# Altium schematic sheet ESP32_BLE.SchDoc: Access Control
size A; DrawnBy: Q.Thang & T.Khoa; Revision: V1.0.1; SheetNumber: 6; SheetTotal: 16
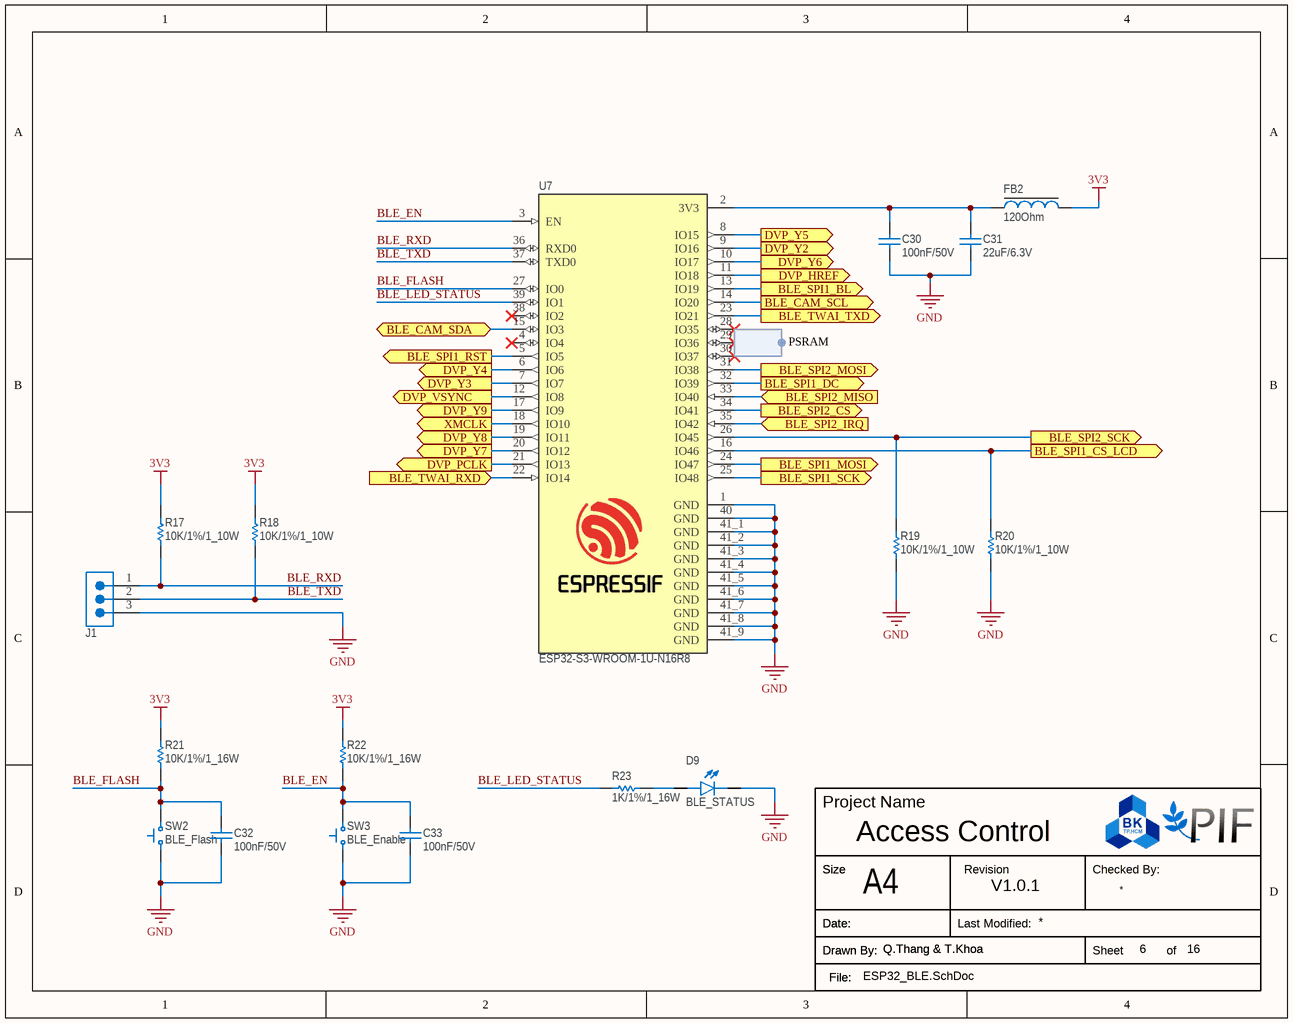
[diagram p0: ESP32_BLE.SchDoc]

## Parts
C30  100nF/50V  [CAP_0805]
C31  22uF/6.3V  [CAP_0805]
C32  100nF/50V  [CAP_0402]
C33  100nF/50V  [CAP_0402]
D9  BLE_STATUS  [LED_0603Y]
FB2  120Ohm  [Ferrite_Bead_0805]
J1  2.54mm_2P  [Header_2.54mm_3P]  (value not drawn)
R17  10K/1%/1_10W  [Resistor_0603]
R18  10K/1%/1_10W  [Resistor_0603]
R19  10K/1%/1_10W  [Resistor_0603]
R20  10K/1%/1_10W  [Resistor_0603]
R21  10K/1%/1_16W  [RESISTOR_0402]
R22  10K/1%/1_16W  [RESISTOR_0402]
R23  1K/1%/1_16W  [RESISTOR_0402]
SW2  BLE_Flash  [Button_3x4mm_SMD_2P]
SW3  BLE_Enable  [Button_3x4mm_SMD_2P]
U7  ESP32-S3-WROOM-1U-N16R8  [XCVR_ESP32-S3-WROOM-1U-N16R8]

## Ports
BLE_CAM_SCL (out, see Overview_Schematic[3B], Camera[2B]), BLE_CAM_SDA (bidir, see Overview_Schematic[3B], Camera[2B]), BLE_SPI1_BL (out, see Overview_Schematic[4C], Display[1D]), BLE_SPI1_CS_LCD (out, see Overview_Schematic[3C], Display[2A]), BLE_SPI1_DC (out, see Overview_Schematic[3C], Display[2A]), BLE_SPI1_MOSI (out, see Overview_Schematic[3C], Display[2A]), BLE_SPI1_RST (out, see Overview_Schematic[3C], Display[2A]), BLE_SPI1_SCK (out, see Overview_Schematic[3C], Display[2B]), BLE_SPI2_CS (out, see Overview_Schematic[3C], Display[2B]), BLE_SPI2_IRQ (in, see Overview_Schematic[3C], Display[2B]), BLE_SPI2_MISO (in, see Overview_Schematic[3C], Display[2B]), BLE_SPI2_MOSI (out, see Overview_Schematic[3C], Display[2B]), BLE_SPI2_SCK (out, see Overview_Schematic[3C], Display[2B]), BLE_TWAI_RXD (in, see Overview_Schematic[4B]), BLE_TWAI_TXD (out, see Overview_Schematic[4B]), DVP_HREF (out, see Overview_Schematic[3B], Camera[3B]), DVP_PCLK (out, see Overview_Schematic[3B], Camera[3B]), DVP_VSYNC (out, see Overview_Schematic[3B], Camera[3B]), DVP_Y2 (out, see Overview_Schematic[3B], Camera[3C]), DVP_Y3 (out, see Overview_Schematic[3B], Camera[3C]), DVP_Y4 (out, see Overview_Schematic[3B], Camera[3C]), DVP_Y5 (out, see Overview_Schematic[3B], Camera[3C]), DVP_Y6 (out, see Overview_Schematic[3B], Camera[3B]), DVP_Y7 (out, see Overview_Schematic[3B], Camera[3B]), DVP_Y8 (out, see Overview_Schematic[3B], Camera[3B]), DVP_Y9 (out, see Overview_Schematic[3B], Camera[3B]), XMCLK (out, see Overview_Schematic[3B], Camera[3B])

## Harnesses
*: 

## Nets
3V3: FB2.2 R17.2 R18.2 R21.2 R22.2
GND: C30.1 C31.1 C32.1 C33.1 D9.C J1.3 R19.1 R20.1 SW2.1 SW3.1 U7.1(GND) U7.40(GND) U7.41_1(GND) U7.41_2(GND) U7.41_3(GND) U7.41_4(GND) U7.41_5(GND) U7.41_6(GND) U7.41_7(GND) U7.41_8(GND) U7.41_9(GND)
BLE_CAM_SCL: U7.14(IO20) ; port BLE_CAM_SCL
BLE_CAM_SDA: U7.15(IO3) ; port BLE_CAM_SDA
BLE_EN: C33.2 R22.1 SW3.2 U7.3(EN)
BLE_FLASH: C32.2 R21.1 SW2.2 U7.27(IO0)
BLE_LED_STATUS: R23.1 U7.39(IO1)
BLE_RXD: J1.1 R17.1 U7.36(RXD0)
BLE_SPI1_BL: U7.13(IO19) ; port BLE_SPI1_BL
BLE_SPI1_CS_LCD: R20.2 U7.16(IO46) ; port BLE_SPI1_CS_LCD
BLE_SPI1_DC: U7.32(IO39) ; port BLE_SPI1_DC
BLE_SPI1_MOSI: U7.24(IO47) ; port BLE_SPI1_MOSI
BLE_SPI1_RST: U7.5(IO5) ; port BLE_SPI1_RST
BLE_SPI1_SCK: U7.25(IO48) ; port BLE_SPI1_SCK
BLE_SPI2_CS: U7.34(IO41) ; port BLE_SPI2_CS
BLE_SPI2_IRQ: U7.35(IO42) ; port BLE_SPI2_IRQ
BLE_SPI2_MISO: U7.33(IO40) ; port BLE_SPI2_MISO
BLE_SPI2_MOSI: U7.31(IO38) ; port BLE_SPI2_MOSI
BLE_SPI2_SCK: R19.2 U7.26(IO45) ; port BLE_SPI2_SCK
BLE_TWAI_RXD: U7.22(IO14) ; port BLE_TWAI_RXD
BLE_TWAI_TXD: U7.23(IO21) ; port BLE_TWAI_TXD
BLE_TXD: J1.2 R18.1 U7.37(TXD0)
DVP_HREF: U7.11(IO18) ; port DVP_HREF
DVP_PCLK: U7.21(IO13) ; port DVP_PCLK
DVP_VSYNC: U7.12(IO8) ; port DVP_VSYNC
DVP_Y2: U7.9(IO16) ; port DVP_Y2
DVP_Y3: U7.7(IO7) ; port DVP_Y3
DVP_Y4: U7.6(IO6) ; port DVP_Y4
DVP_Y5: U7.8(IO15) ; port DVP_Y5
DVP_Y6: U7.10(IO17) ; port DVP_Y6
DVP_Y7: U7.20(IO12) ; port DVP_Y7
DVP_Y8: U7.19(IO11) ; port DVP_Y8
DVP_Y9: U7.17(IO9) ; port DVP_Y9
XMCLK: U7.18(IO10) ; port XMCLK
NetC30_2: C30.2 C31.2 FB2.1 U7.2(3V3)
NetD9_A: D9.A R23.2

Not connected (* = marked no-connect by the designer): U7 4(IO4)* 28(IO35)* 29(IO36)* 30(IO37)* 38(IO2)*

## Notes on the sheet
- PSRAM
- Project Name
- Size
- A4
- Revision
- Checked By:
- Drawn By:
- Date:
- File:
- Last Modified:
- Sheet
- of

## Library data of the parts
C30 = Ceramic_Cap_100nF_50V_0805: CAP, size 0805, 100nF, 50V; Supply Part Number: Tụ Gốm 0805 100nF (0.1uF) 50V; Supply Name: Thegioiic; Datasheet: *; Supply URL: https://www.thegioiic.com/tu-gom-0805-100nf-0-1uf-50v
C31 = Ceramic_Cap_22uF_6.3V_0805: CAP, size 0805, 22uF, 6.3V; Supply Part Number: Tụ Gốm 0805 22uF 6.3V; Supply Name: Thegioiic; Datasheet: *; Supply URL: https://www.thegioiic.com/tu-gom-0805-22uf-6-3v
C32 C33 = Ceramic_Cap_100nF_50V_0402: CAP, size 0402, 100nF, 50V; Supply Part Number: Tụ Gốm 0402 100nF (0.1uF) 50V; Supply Name: Thegioiic; Datasheet: *; Supply URL: https://www.thegioiic.com/tu-gom-0402-100nf-0-1uf-50v
D9 = LED_Yellow_0603: LED Yellow 0603; Supply Part Number: LED Vàng 0603 Dán SMD Trong Suốt Harvatek; Supply Name: Thegioiic; Supply URL: https://www.thegioiic.com/led-vang-0603-dan-smd-trong-suot-harvatek
FB2 = Ferrite_Bead_120Ohm_2A_0805: Ferrite Bead, size 0805, 120Ohm, 2A; Supply Part Number: CBW201209U121T Ferrite Beads 2A 120 Ohm 0805; Supply Name: Thegioiic; Supply URL: https://www.thegioiic.com/cbw201209u121t-ferrite-beads-2a-120-ohm-0805
J1 = Header_2.54mm_3P: Hàng Rào Đực Đơn 2.54mm 40 Chân 1 Hàng Cao 11.2mm Xuyên Lỗ; Supply Name: Thegioiic; Supply Part Number: Hàng Rào Đực Đơn 2.54mm 40 Chân 1 Hàng Cao 11.2mm Xuyên Lỗ; Supply URL: https://www.thegioiic.com/hang-rao-duc-don-2-54mm-40-chan-1-hang-cao-11-2mm-xuyen-lo
R17-R20 = Res_10K_0603_1%: Resistor 0603 10KOhm 1% 1_10W; Supply Part Number: Điện Trở 10 KOhm 0603 1%; Supply Name: Thegioiic; Supply URL: https://www.thegioiic.com/dien-tro-10-kohm-0603-1-
R21 R22 = Res_10K_0402_1%: Resistor 0402 10KOhm 1% 1_16W; Supply Part Number: Điện Trở 10 KOhm 0402 1%; Supply Name: Thegioiic; Supply URL: https://www.thegioiic.com/dien-tro-10-kohm-0402-1-
R23 = Res_1K_0402_1%: Resistor 0402 1KOhm 1% 1_16W; Supply Part Number: Điện Trở 1 KOhm 0402 1%; Supply Name: Thegioiic; Supply URL: https://www.thegioiic.com/dien-tro-1-kohm-0402-1-
SW2 SW3 = Button_SMD_3x4mm_2P: Supply Part Number: Nút Nhấn 3x4mm Cao 2.5mm 2 Chân SMD; Supply Name: Thegioiic; Datasheet: *; Supply URL: https://www.thegioiic.com/nut-nhan-3x4mm-cao-2-5mm-2-chan-smd
U7 = ESP32-S3-WROOM-1U-N16R8: Bluetooth, WiFi 802.11b/g/n, Bluetooth v5.0 Transceiver Module 2.4GHz Antenna Not Included, U.FL Surface Mount; Supply Part Number: ESP32-S3-WROOM-1U-N16R8 Thu Phát Wifi BLE ESP32 16MB; Supply Name: DienTuTuyetNga; Datasheet: https://www.espressif.com/sites/default/files/documentation/esp32-s3_datasheet_en.pdf; Supply URL: https://dientutuyetnga.com/products/esp32-s3-wroom-1u-n16r8-thu-phat-wifi-ble-esp32-16mb